# EasyEDA Pro project ProProject_ESP8266_healthy_2025-04-15.epro

# Schematic Schematic1
Create Date: 2025-03-22; Page Name: P1; Project Name: ESP8266_healthy; Schematic Name: Schematic1; Update Date: 2025-03-24; Company: 嘉立创EDA; Page Size: A4; Version: V1.0
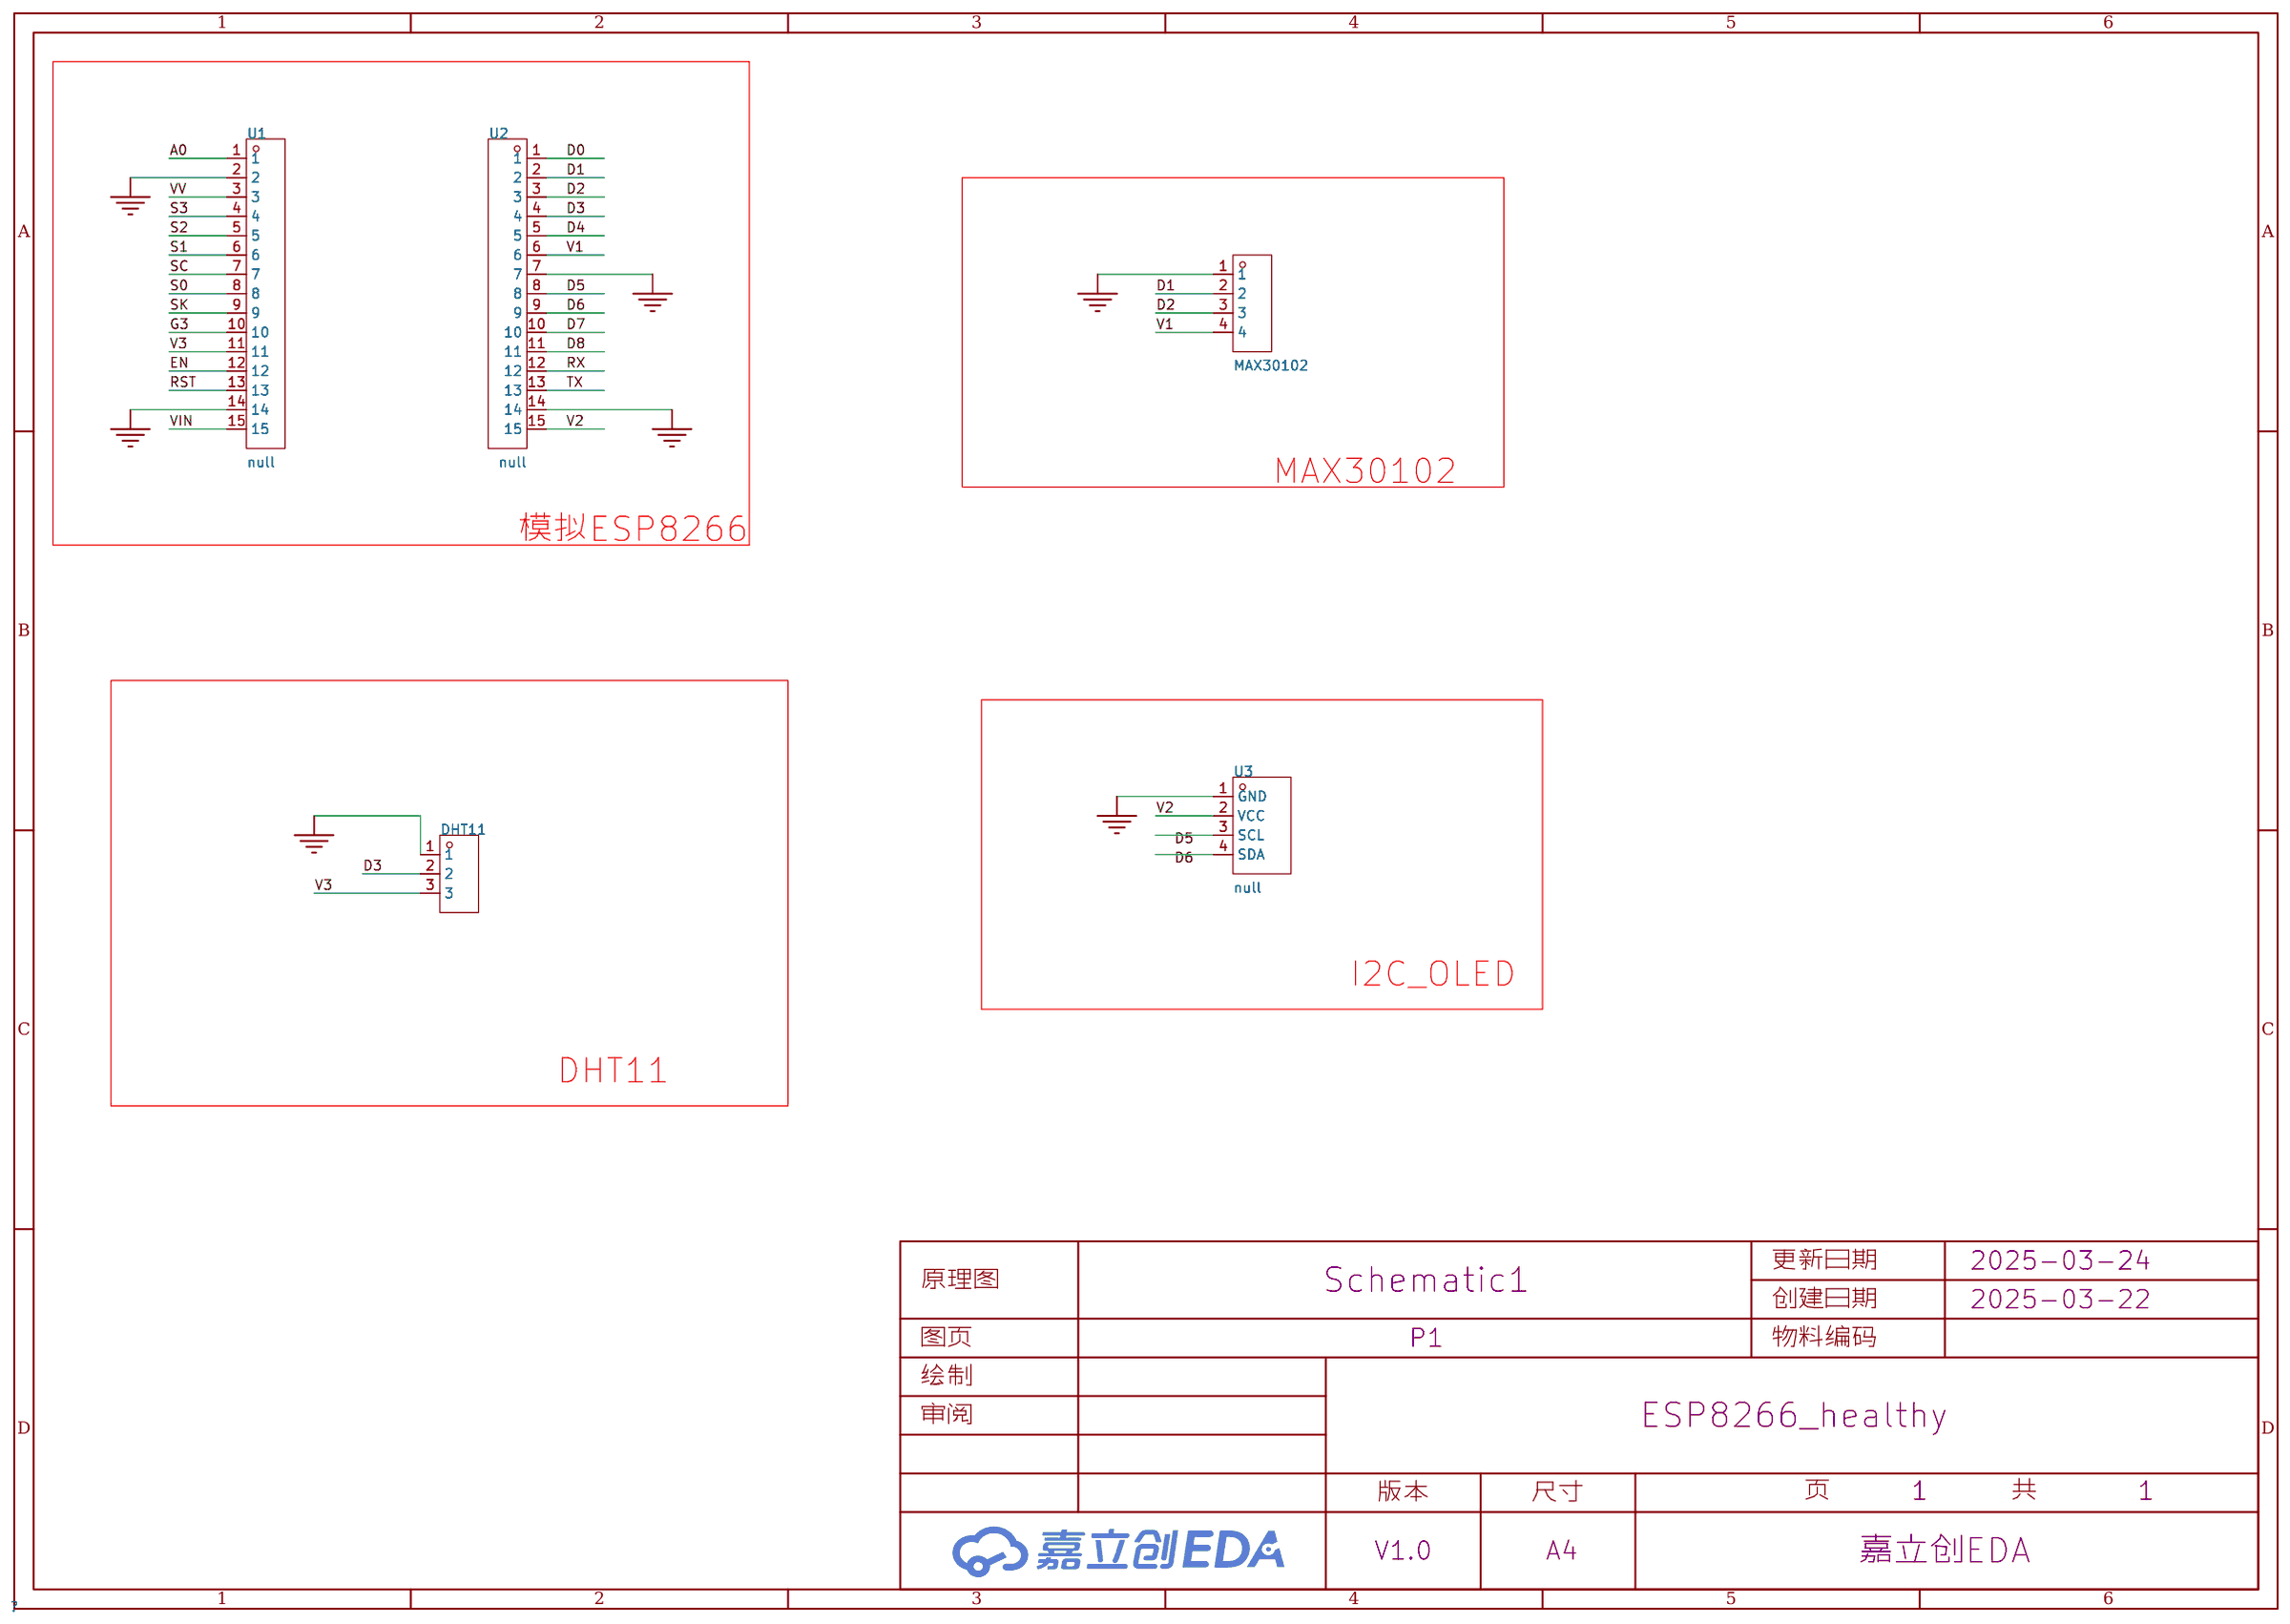
[diagram p0: schematic sheet]

## Parts
DHT11  VCC  [HDR-TH_3P-P2.54-V-F]
MAX30102  -  [HDR-TH_4P-P2.54-V-F]
U1  null  [HDR-TH_15P-P2.54-V-F]
U2  null  [HDR-TH_15P-P2.54-V-F]
U3  null  [OLED-TH_L27.8-W27.2-P2.54_C9900033791]

## Library data of the parts
DHT11 = HDR-F_2.54_1x3P: Supplier Part: C541850; Supplier Footprint: 插件
MAX30102 = HDR-F_2.54_1x4P: Supplier Part: C2718488; Supplier Footprint: 插件
U1 = KH-2.54FH-1X15P-H8.5: 插孔结构:1x15P;间距:2.54mm;行距:-;圆孔/方孔:方孔;安装类型:直插;排数:单排;总孔位数:15P;额定电流:3A;额定电压:-;插孔方向:顶部;塑高:8.5mm;工作温度范围:-40℃~+105℃;; LCSC Part Name: 间距:2.54mm 1x15P 直插; Supplier Part: C2932676; Manufacturer: kinghelm(金航标); Supplier Footprint: 插件,P=2.54mm; JLCPCB Part Class: Extended Part; Datasheet: https://atta.szlcsc.com/upload/public/pdf/source/20211220/977AA415CFA981E866620A80068F25CA.pdf; Supplier: LCSC; Holes Structure: 1x15P; Pitch: 2.54mm; Circular Hole / Square Hole: 方孔; Mounting Type: 直插; Number of Rows: 单排; Number of Holes: 15P; Current Rating (Max): 3A; Holes Direction: 顶部; Insulation Height: 8.5mm; Operating Temperature Range: -40℃~+105℃
U2 = KH-2.54FH-1X15P-H8.5: 插孔结构:1x15P;间距:2.54mm;行距:-;圆孔/方孔:方孔;安装类型:直插;排数:单排;总孔位数:15P;额定电流:3A;额定电压:-;插孔方向:顶部;塑高:8.5mm;工作温度范围:-40℃~+105℃;; LCSC Part Name: 间距:2.54mm 1x15P 直插; Supplier Part: C2932676; Manufacturer: kinghelm(金航标); Manufacturer Part: ESP8266 CH340 串口WIFI模块; Supplier Footprint: 插件,P=2.54mm; JLCPCB Part Class: Extended Part; Datasheet: https://atta.szlcsc.com/upload/public/pdf/source/20211220/977AA415CFA981E866620A80068F25CA.pdf; Supplier: LCSC; Holes Structure: 1x15P; Pitch: 2.54mm; Circular Hole / Square Hole: 方孔; Mounting Type: 直插; Number of Rows: 单排; Number of Holes: 15P; Current Rating (Max): 3A; Holes Direction: 顶部; Insulation Height: 8.5mm; Operating Temperature Range: -40℃~+105℃
U3 = HS96L03W2C03: 主控芯片:SSD1315;接口类型:I2C;尺寸(inch):0.96;像素分辨率:128x64;; LCSC Part Name: 0.96寸OLED显示屏窄白光IIC; Supplier Part: C5248080; Manufacturer: HS(汉昇); Manufacturer Part: OLED; JLCPCB Part Class: Extended Part; Datasheet: https://atta.szlcsc.com/upload/public/pdf/source/20230627/763D01F79A90007632F098068C7C8AD9.pdf; Supplier: LCSC; Main Control Chip: SSD1315; Interface Type: I2C; Size: 0.96; Pixel Resolution: 128x64; Operating Temperature: -40℃~+70℃

## Nets
GND: DHT11.1 MAX30102.1 U1.2 U1.14 U2.7 U2.14 U3.1(GND)
V1: MAX30102.4 U2.6
V2: U2.15 U3.2(VCC)
V3: DHT11.3 U1.11
VIN: U1.15
A0: U1.1
D0: U2.1
D1: MAX30102.2 U2.2
D2: MAX30102.3 U2.3
D3: DHT11.2 U2.4
D4: U2.5
D5: U2.8 U3.3(SCL)
D6: U2.9 U3.4(SDA)
D7: U2.10
D8: U2.11
EN: U1.12
G3: U1.10
RST: U1.13
RX: U2.12
S0: U1.8
S1: U1.6
S2: U1.5
S3: U1.4
SC: U1.7
SK: U1.9
TX: U2.13
VV: U1.3

## Notes on the sheet
- MAX30102
- 模拟ESP8266
- I2C_OLED
- DHT11

# Board PCB1
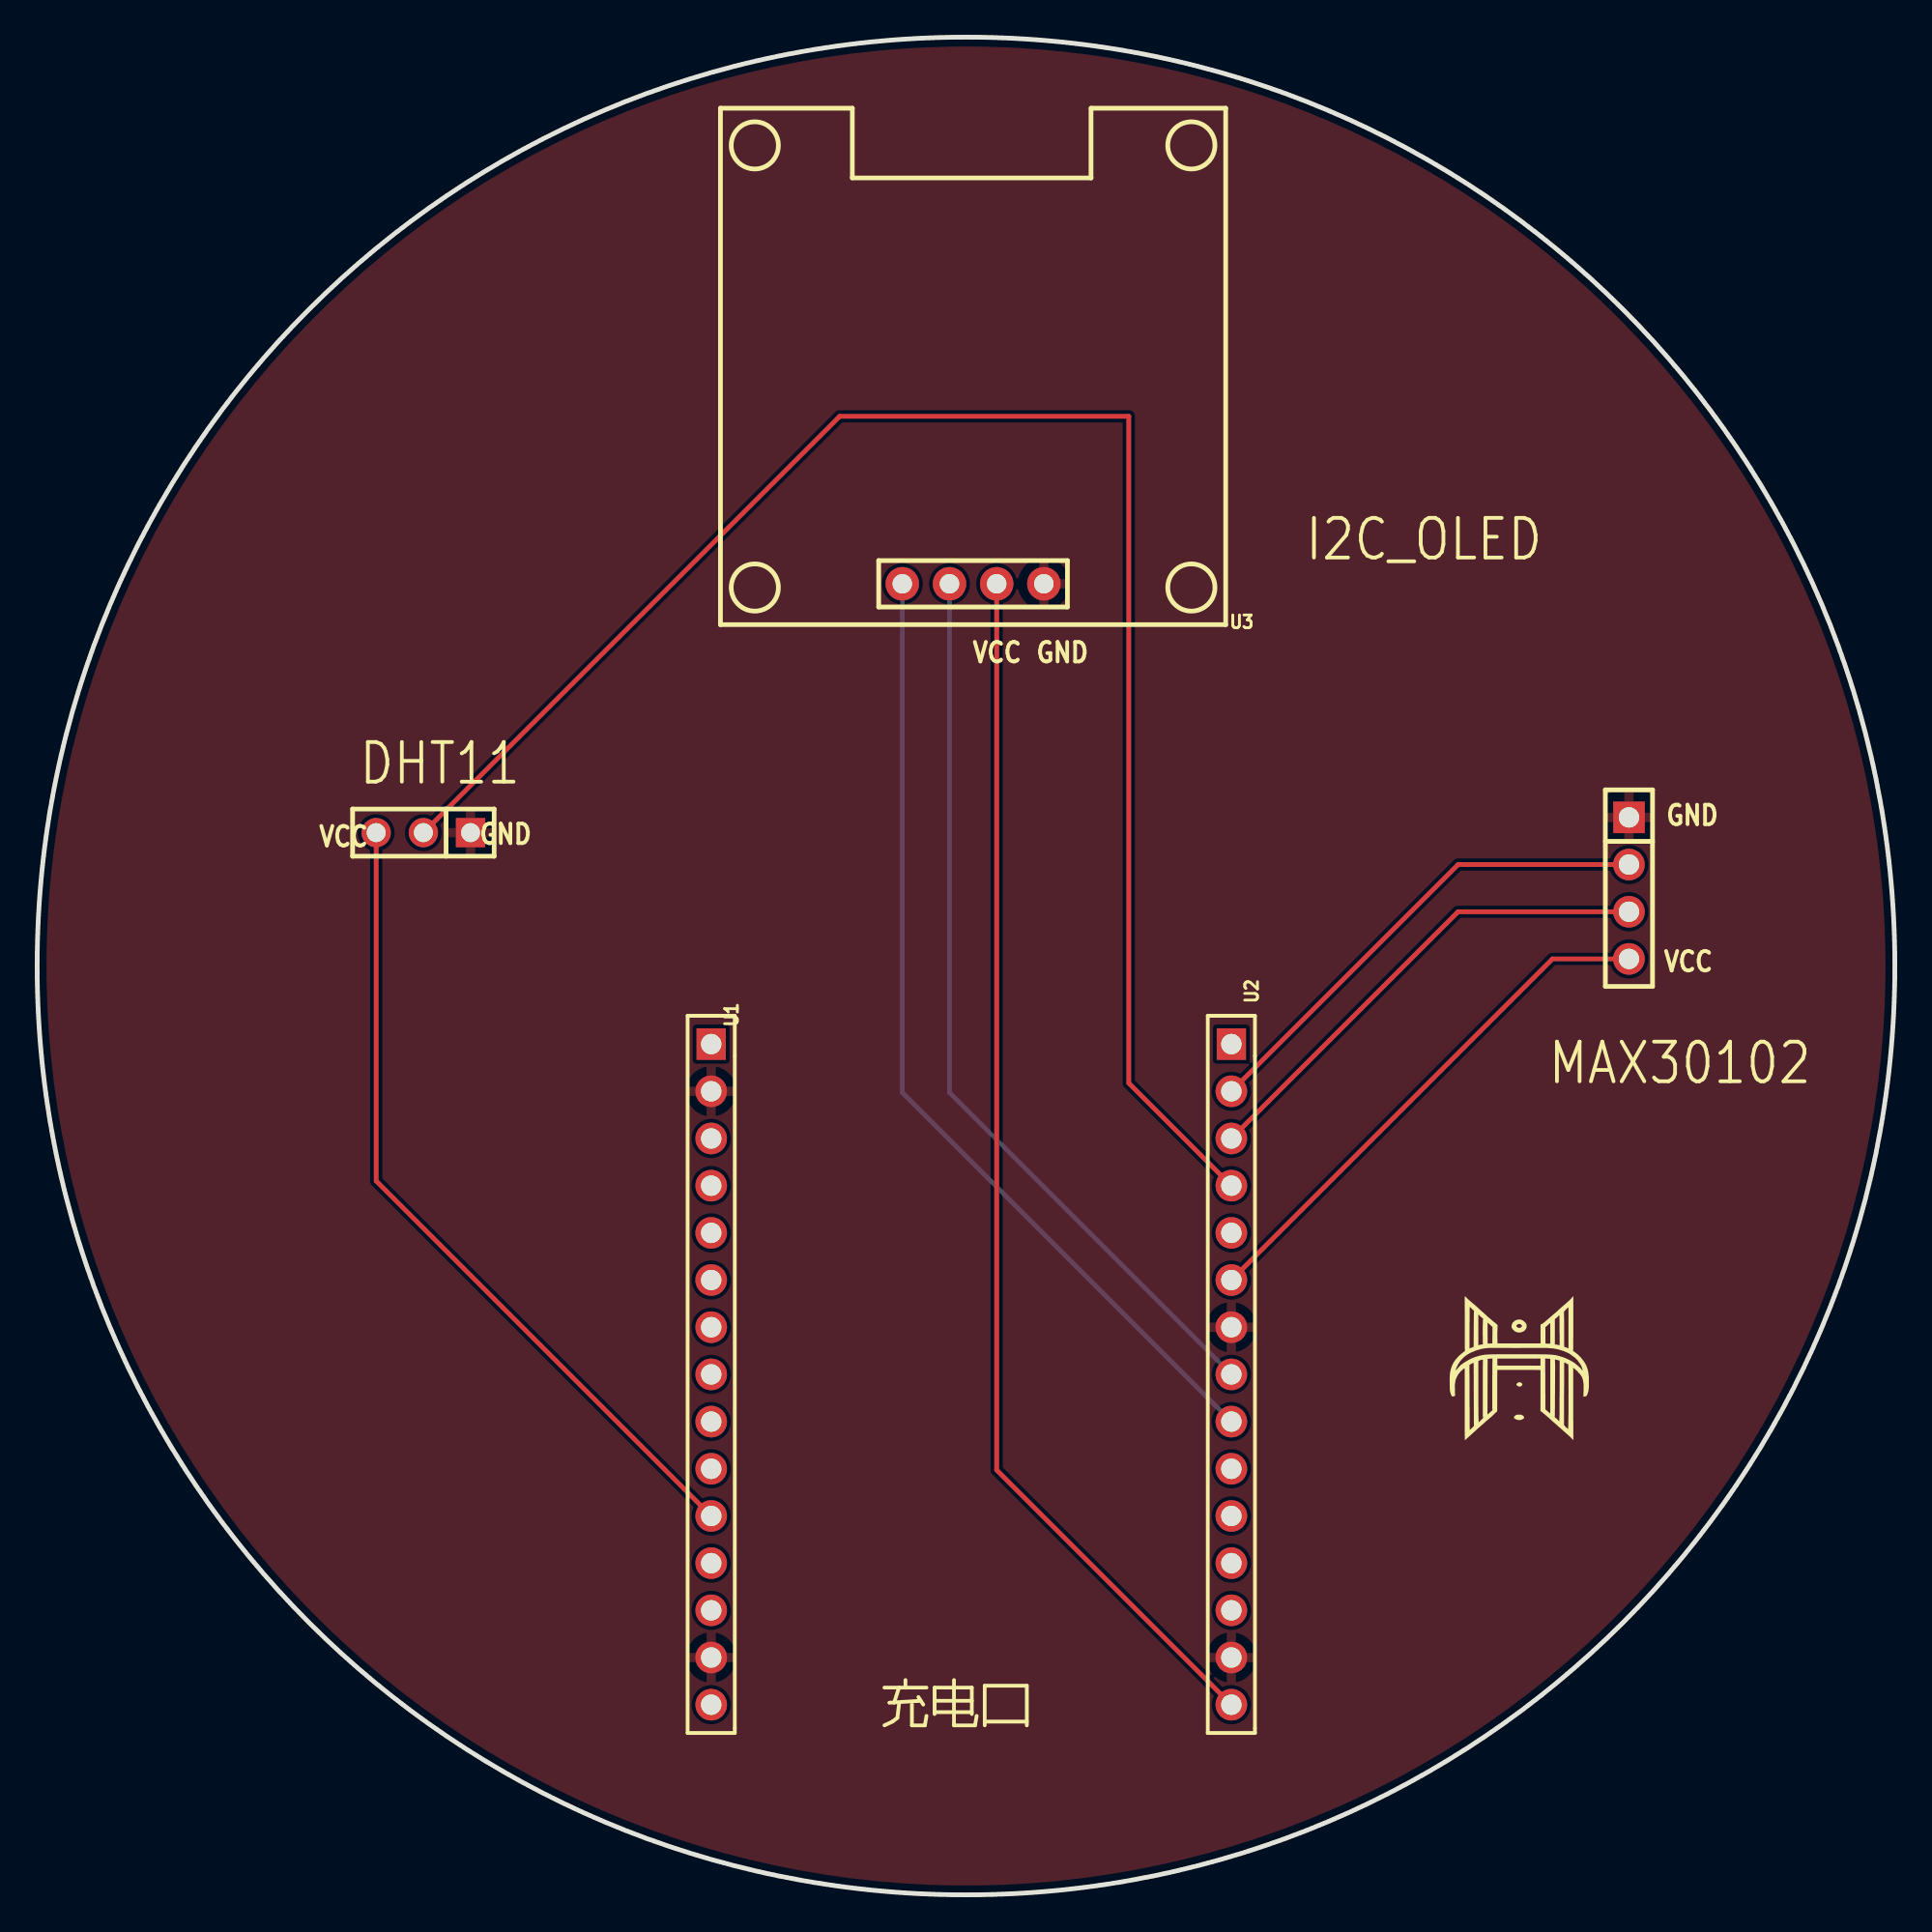
[diagram p1: board, top side]
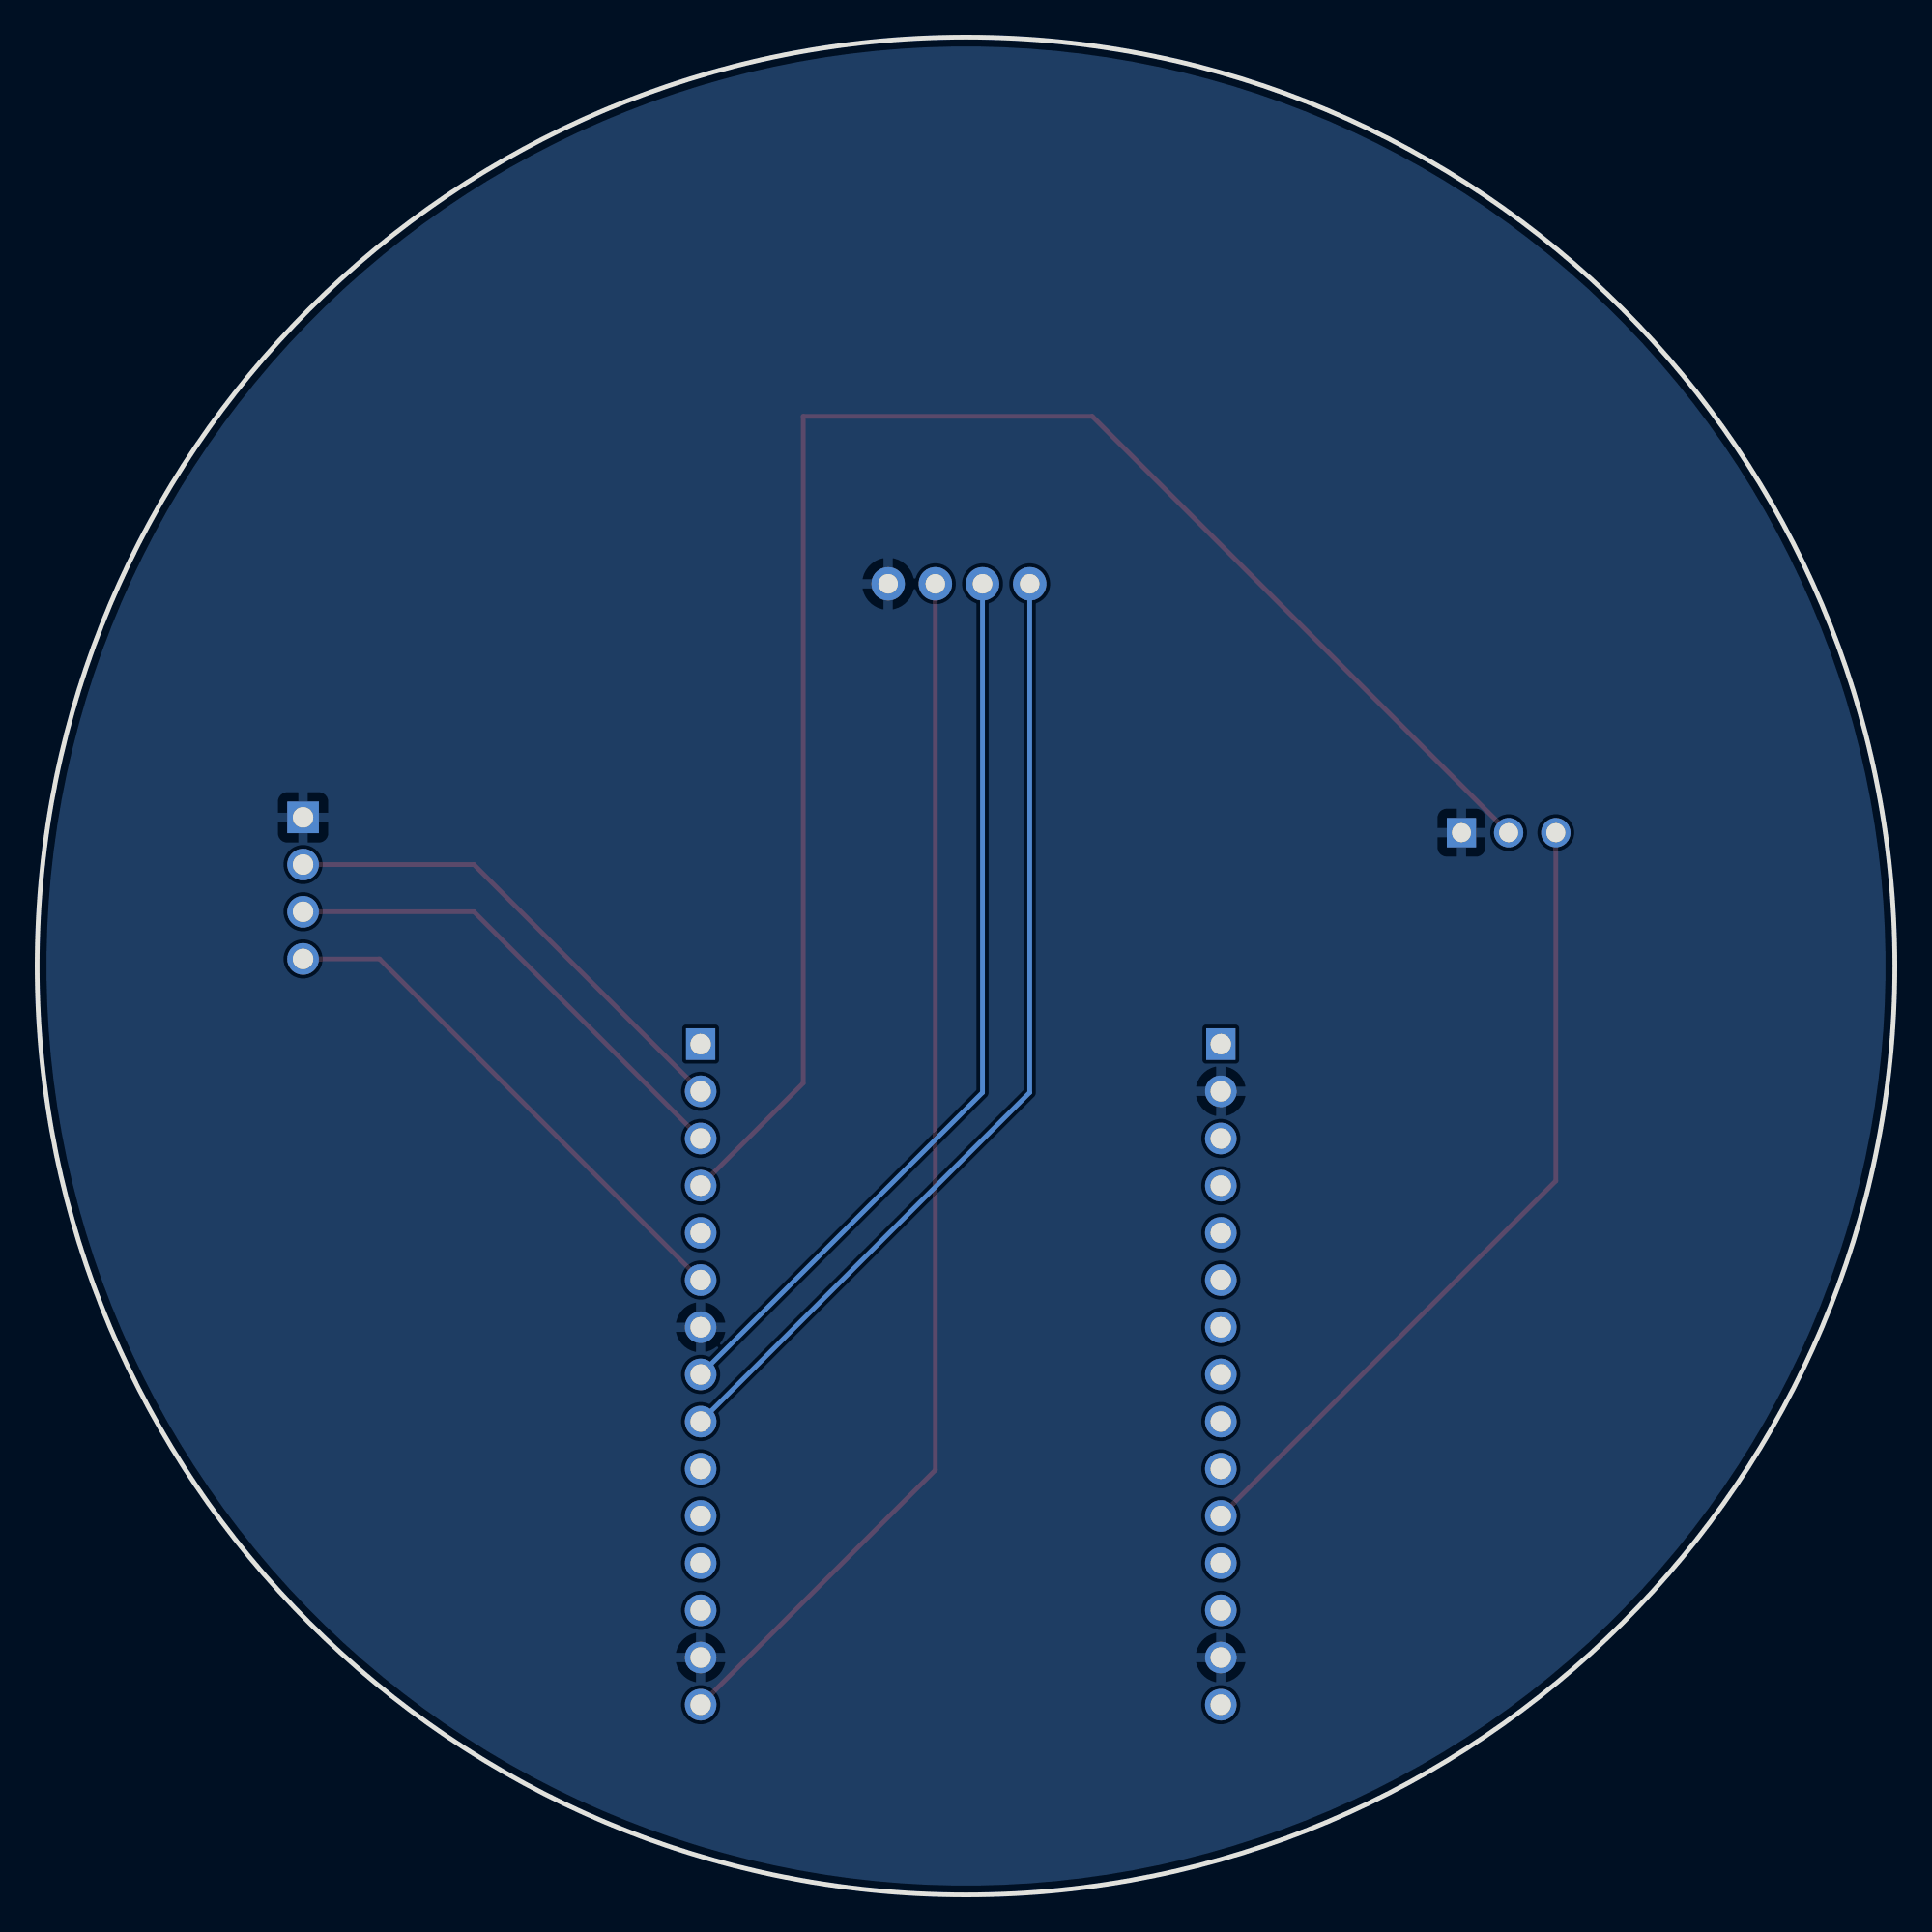
[diagram p2: board, bottom side, seen from below]

Outline 100 x 100 mm; copper layers: Top Layer, Bottom Layer. Coordinates in mm from the lower left corner of the outline.
Outline path: circle c50,50 r50
Stack: Top Layer 0.035mm / Dielectric1 1.51mm FR4 er 4.5 / Bottom Layer 0.035mm

## Design rules (mm)
template: JLCPCB Capability(Two Layers Board)
spacing copperThickness1oz (default): track to track 0.102, other pairs 0.152 to 0.3
spacing copperThickness2oz: track to track 0.203, other pairs 0.152 to 0.3
track width copperThickness1oz (default): min 0.127, default 0.254, max 2.54
track width copperThickness2oz: min 0.203, default 0.254, max 2.54
differential pair differentialPair (default): width min 0.127, default 0.254, max 2.54; gap min 0.152, default 0.152
via viaSize (default): diameter min 0.5, default 0.61, max 10; hole min 0.3, default 0.305, max 6.3

## Placement (name value [footprint] x y rotation side)
MAX30102  -  [HDR-TH_4P-P2.54-V-F]  85.69 54.19 270 top
NOREF  -  [HDR-TH_3P-P2.54-V-F]  20.79 57.18 180 top
U1  null  [HDR-TH_15P-P2.54-V-F]  36.28 28.02 270 top
U2  null  [HDR-TH_15P-P2.54-V-F]  64.28 28.02 270 top
U3  null  [OLED-TH_L27.8-W27.2-P2.54_C9900033791]  50.38 70.57 180 top

## Footprints (pads in the part's own frame, mm; a bottom-side part is the same pattern mirrored in y, then rotated)
HDR-TH_3P-P2.54-V-F
  rect 1.575x1.575 hole 1.02: 1(-2.54,0)
  round 1.575 hole 1.02: 2(0,0) 3(2.54,0)
HDR-TH_4P-P2.54-V-F
  rect 1.7x1.7 hole 1.1: 1(-3.81,0)
  round 1.7 hole 1.1: 2(-1.27,0) 3(1.27,0) 4(3.81,0)
HDR-TH_15P-P2.54-V-F
  rect 1.7x1.575 hole 1.1: 1(-17.78,0)
  round 1.7 hole 1.1: 2(-15.24,0) 3(-12.7,0) 4(-10.16,0) 5(-7.62,0) 6(-5.08,0) 7(-2.54,0) 8(0,0) 9(2.54,0) 10(5.08,0) 11(7.62,0) 12(10.16,0) 13(12.7,0) 14(15.24,0) 15(17.78,0)
OLED-TH_L27.8-W27.2-P2.54_C9900033791
  round 1.8 hole 1.05: 1(-3.81,0) 2(-1.27,0) 3(1.27,0) 4(3.81,0)

## Nets
As in the schematic, except:
GND: MAX30102.1 NOREF.1 U1.2 U1.14 U2.7 U2.14 U3.1
V3: NOREF.3 U1.11
D3: NOREF.2 U2.4

## Routing (per net, layer and track width the routed paths; a pad name or vN(x,y) marks a point on that pad's centre or on a via; arc(x,y) is an arc through that point)
V1: length 28.6
  Top Layer w0.254: MAX30102.4 81.57,50.38 U2.6
V2: length 65.6
  Top Layer w0.254: U3.2 51.65,22.87 U2.15
V3: length 44.3
  Top Layer w0.254: NOREF.3 18.25,38.43 U1.11
D1: length 26.5
  Top Layer w0.254: MAX30102.2 76.49,55.46 U2.2
D2: length 26.5
  Top Layer w0.254: MAX30102.3 76.49,52.92 U2.3
D3: length 91.5
  Top Layer w0.254: U2.4 58.76,43.7 58.76,79.59 43.2,79.59 NOREF.2
  Bottom Layer w0.254: NOREF.2 21.33,57.18
D5: length 48.8
  Bottom Layer w0.254: U3.3 49.11,43.19 U2.8
D6: length 52.4
  Bottom Layer w0.254: U2.9 46.57,43.19 U3.4

## Copper pours and planes (outline as drawn; the poured copper is in the pictures)
GND on Top Layer: 110.37,48.99 110.33,50.53 110.25,52.07 110.13,53.6 109.98,55.13 109.78,56.66 109.55,58.18 109.28,59.7 108.97,61.2 108.62,62.7 108.23,64.19 107.81,65.67 107.35,67.14 106.85,68.6 106.32,70.04 105.75,71.47 105.14,72.88 104.5,74.28 103.82,75.67 103.11,77.03 102.36,78.38 101.58,79.7 100.76,81.01 99.92,82.29 99.04,83.56 98.13,84.8 97.18,86.01 96.21,87.21 95.21,88.37 94.18,89.52 93.12,90.63 92.03,91.72 90.91,92.78 89.77,93.81 88.6,94.82 87.41,95.79 86.19,96.73 84.95,97.64 83.69,98.52 82.4,99.37 81.1,100.18 79.77,100.96 78.43,101.71 77.06,102.42 75.68,103.1 74.28,103.74 72.87,104.35 71.44,104.92 69.99,105.45 68.54,105.95 67.07,106.41 65.59,106.84 64.1,107.22 62.6,107.57 61.09,107.88 59.58,108.15 58.06,108.38 56.53,108.58 55,108.73 53.46,108.85 51.93,108.93 50.39,108.97 48.85,108.97 47.31,108.93 45.77,108.85 44.24,108.73 42.71,108.58 41.18,108.38 39.66,108.15 38.14,107.88 36.64,107.57 35.14,107.22 33.65,106.84 32.17,106.41 30.7,105.95 29.24,105.45 27.8,104.92 26.37,104.35 24.96,103.74 23.56,103.1 22.18,102.42 20.81,101.71 19.47,100.96 18.14,100.18 16.83,99.37 15.55,98.52 14.28,97.64 13.04,96.73 11.83,95.79 10.63,94.82 9.47,93.81 8.32,92.78 7.21,91.72 6.12,90.63 5.06,89.52 4.03,88.37 3.03,87.21 2.05,86.01 1.11,84.8 0.2,83.56 -0.68,82.29 -1.53,81.01 -2.34,79.7 -3.12,78.38 -3.87,77.03 -4.58,75.67 -5.26,74.28 -5.9,72.88 -6.51,71.47 -7.08,70.04 -7.61,68.6 -8.11,67.14 -8.57,65.67 -9,64.19 -9.38,62.7 -9.73,61.2 -10.04,59.7 -10.31,58.18 -10.54,56.66 -10.74,55.13 -10.89,53.6 -11.01,52.07 -11.09,50.53 -11.13,48.99 -11.13,47.45 -11.09,45.91 -11.01,44.38 -10.89,42.84 -10.74,41.31 -10.54,39.78 -10.31,38.26 -10.04,36.75 -9.73,35.24 -9.38,33.74 -9,32.25 -8.57,30.77 -8.11,29.3 -7.61,27.85 -7.08,26.4 -6.51,24.97 -5.9,23.56 -5.26,22.16 -4.58,20.78 -3.87,19.41 -3.12,18.07 -2.34,16.74 -1.53,15.44 -0.68,14.15 0.2,12.89 1.11,11.65 2.05,10.43 3.03,9.24 4.03,8.07 5.06,6.93 6.12,5.81 7.21,4.72 8.32,3.66 9.47,2.63 10.63,1.63 11.83,0.66 13.04,-0.29 14.28,-1.2 15.55,-2.08 16.83,-2.92 18.14,-3.74 19.47,-4.52 20.81,-5.27 22.18,-5.98 23.56,-6.66 24.96,-7.3 26.37,-7.91 27.8,-8.48 29.24,-9.01 30.7,-9.51 32.17,-9.97 33.65,-10.39 35.14,-10.78 36.64,-11.13 38.14,-11.44 39.66,-11.71 41.18,-11.94 42.71,-12.14 44.24,-12.29 45.77,-12.41 47.31,-12.49 48.85,-12.52 50.39,-12.52 51.93,-12.49 53.46,-12.41 55,-12.29 56.53,-12.14 58.06,-11.94 59.58,-11.71 61.09,-11.44 62.6,-11.13 64.1,-10.78 65.59,-10.39 67.07,-9.97 68.54,-9.51 69.99,-9.01 71.44,-8.48 72.87,-7.91 74.28,-7.3 75.68,-6.66 77.06,-5.98 78.43,-5.27 79.77,-4.52 81.1,-3.74 82.4,-2.92 83.69,-2.08 84.95,-1.2 86.19,-0.29 87.41,0.66 88.6,1.63 89.77,2.63 90.91,3.66 92.03,4.72 93.12,5.81 94.18,6.93 95.21,8.07 96.21,9.24 97.18,10.43 98.13,11.65 99.04,12.89 99.92,14.15 100.76,15.44 101.58,16.74 102.36,18.07 103.11,19.41 103.82,20.78 104.5,22.16 105.14,23.56 105.75,24.97 106.32,26.4 106.85,27.85 107.35,29.3 107.81,30.77 108.23,32.25 108.62,33.74 108.97,35.24 109.28,36.75 109.55,38.26 109.78,39.78 109.98,41.31 110.13,42.84 110.25,44.38 110.33,45.91 110.37,47.45
GND on Bottom Layer: 107.17,52.68 107.13,54.24 107.05,55.79 106.93,57.34 106.77,58.89 106.58,60.43 106.34,61.96 106.07,63.49 105.76,65.02 105.4,66.53 105.01,68.04 104.59,69.53 104.12,71.02 103.62,72.49 103.08,73.94 102.5,75.39 101.89,76.82 101.24,78.23 100.55,79.62 99.83,81 99.08,82.36 98.29,83.7 97.47,85.02 96.61,86.32 95.73,87.6 94.81,88.85 93.85,90.08 92.87,91.28 91.86,92.46 90.82,93.62 89.75,94.74 88.65,95.84 87.52,96.91 86.37,97.95 85.19,98.97 83.98,99.95 82.75,100.9 81.5,101.82 80.22,102.71 78.93,103.57 77.61,104.39 76.27,105.18 74.91,105.93 73.53,106.65 72.13,107.34 70.72,107.98 69.29,108.6 67.85,109.17 66.39,109.71 64.92,110.22 63.44,110.68 61.94,111.11 60.44,111.5 58.92,111.85 57.4,112.16 55.87,112.44 54.33,112.67 52.79,112.87 51.24,113.03 49.69,113.15 48.14,113.22 46.59,113.26 45.03,113.26 43.48,113.22 41.92,113.15 40.37,113.03 38.83,112.87 37.29,112.67 35.75,112.44 34.22,112.16 32.7,111.85 31.18,111.5 29.68,111.11 28.18,110.68 26.7,110.22 25.23,109.71 23.77,109.17 22.33,108.6 20.9,107.98 19.48,107.34 18.09,106.65 16.71,105.93 15.35,105.18 14.01,104.39 12.69,103.57 11.39,102.71 10.12,101.82 8.87,100.9 7.64,99.95 6.43,98.97 5.25,97.95 4.1,96.91 2.97,95.84 1.87,94.74 0.8,93.62 -0.24,92.46 -1.25,91.28 -2.24,90.08 -3.19,88.85 -4.11,87.6 -5,86.32 -5.85,85.02 -6.67,83.7 -7.46,82.36 -8.22,81 -8.94,79.62 -9.62,78.23 -10.27,76.82 -10.88,75.39 -11.46,73.94 -12,72.49 -12.5,71.02 -12.97,69.53 -13.4,68.04 -13.79,66.53 -14.14,65.02 -14.45,63.49 -14.72,61.96 -14.96,60.43 -15.16,58.89 -15.31,57.34 -15.43,55.79 -15.51,54.24 -15.55,52.68 -15.55,51.13 -15.51,49.57 -15.43,48.02 -15.31,46.47 -15.16,44.92 -14.96,43.38 -14.72,41.85 -14.45,40.32 -14.14,38.79 -13.79,37.28 -13.4,35.77 -12.97,34.28 -12.5,32.79 -12,31.32 -11.46,29.87 -10.88,28.42 -10.27,26.99 -9.62,25.58 -8.94,24.19 -8.22,22.81 -7.46,21.45 -6.67,20.11 -5.85,18.79 -5,17.49 -4.11,16.21 -3.19,14.96 -2.24,13.73 -1.25,12.53 -0.24,11.35 0.8,10.19 1.87,9.07 2.97,7.97 4.1,6.9 5.25,5.86 6.43,4.84 7.64,3.86 8.87,2.91 10.12,1.99 11.39,1.1 12.69,0.24 14.01,-0.58 15.35,-1.37 16.71,-2.12 18.09,-2.84 19.48,-3.53 20.9,-4.17 22.33,-4.79 23.77,-5.36 25.23,-5.9 26.7,-6.41 28.18,-6.87 29.68,-7.3 31.18,-7.69 32.7,-8.04 34.22,-8.35 35.75,-8.63 37.29,-8.86 38.83,-9.06 40.37,-9.22 41.92,-9.34 43.48,-9.41 45.03,-9.45 46.59,-9.45 48.14,-9.41 49.69,-9.34 51.24,-9.22 52.79,-9.06 54.33,-8.86 55.87,-8.63 57.4,-8.35 58.92,-8.04 60.44,-7.69 61.94,-7.3 63.44,-6.87 64.92,-6.41 66.39,-5.9 67.85,-5.36 69.29,-4.79 70.72,-4.17 72.13,-3.53 73.53,-2.84 74.91,-2.12 76.27,-1.37 77.61,-0.58 78.93,0.24 80.22,1.1 81.5,1.99 82.75,2.91 83.98,3.86 85.19,4.84 86.37,5.86 87.52,6.9 88.65,7.97 89.75,9.07 90.82,10.19 91.86,11.35 92.87,12.53 93.85,13.73 94.81,14.96 95.73,16.21 96.61,17.49 97.47,18.79 98.29,20.11 99.08,21.45 99.83,22.81 100.55,24.19 101.24,25.58 101.89,26.99 102.5,28.42 103.08,29.87 103.62,31.32 104.12,32.79 104.59,34.28 105.01,35.77 105.4,37.28 105.76,38.79 106.07,40.32 106.34,41.85 106.58,43.38 106.77,44.92 106.93,46.47 107.05,48.02 107.13,49.57 107.17,51.13

## Text on the board
Top Silkscreen Layer: VCC | GND | DHT11 | I2C_OLED | MAX30102 | 充电口
